# Altium project STM32F103_coreboard.PrjPcb
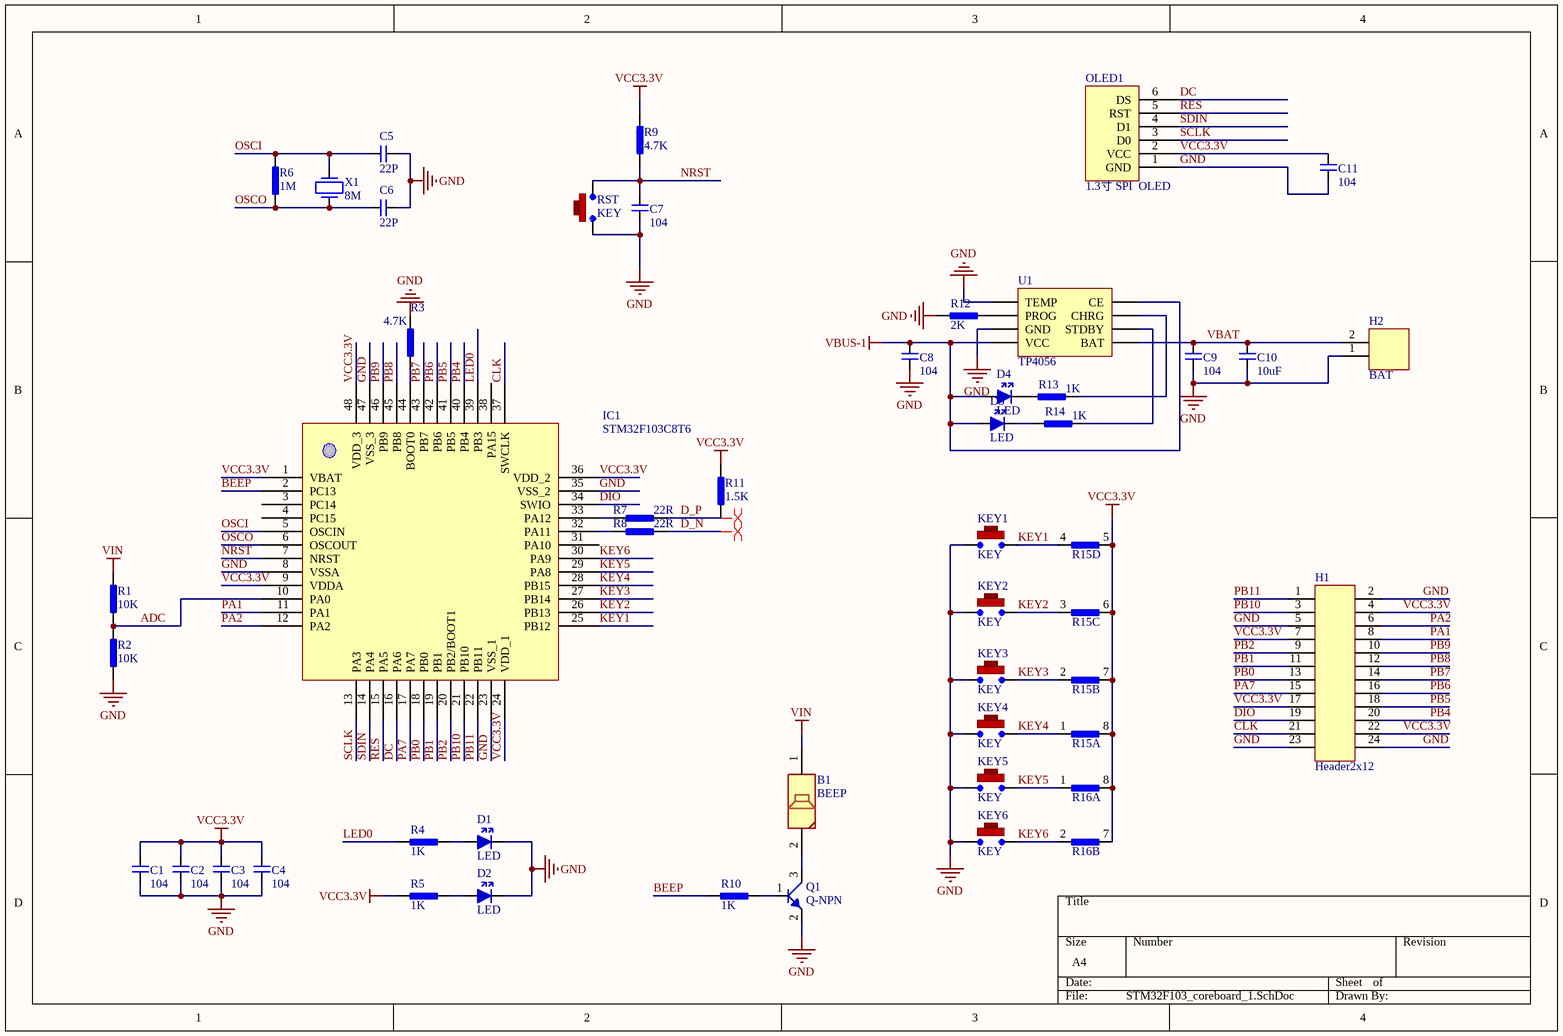
[diagram p0: STM32F103_coreboard_1.SchDoc]
2 sheets, 63 parts. Net scope: global (net labels, ports and power ports of the same name join across sheets).
Board file: STM32F103_coreboard.PcbDoc
Sheets:
  STM32F103_coreboard_1.SchDoc
  STM32F103_coreboard_2.SchDoc

## Sheet STM32F103_coreboard_1.SchDoc
size A4; SheetNumber: 1

### Parts
B1  BEEP  [MLT-9650]
C1  104  [C0603]
C2  104  [C0603]
C3  104  [C0603]
C4  104  [C0603]
C5  22P  [C0603]
C6  22P  [C0603]
C7  104  [C0603]
C8  104  [C0603]
C9  104  [C0603]
C10  10uF  [C0603]
C11  104  [C0603]
D1  LED  [LED0603]
D2  LED  [LED0603]
D3  LED  [LED0603]
D4  LED  [LED0603]
H1  Header2x12  [HDR2X12_2.54_180H]
H2  BAT  [BATIN]
IC1  STM32F103C8T6  [LQFP48]
KEY1  KEY  [KEY3X4X2.5]
KEY2  KEY  [KEY3X4X2.5]
KEY3  KEY  [KEY3X4X2.5]
KEY4  KEY  [KEY3X4X2.5]
KEY5  KEY  [KEY3X4X2.5]
KEY6  KEY  [KEY3X4X2.5]
OLED1  1.3寸 SPI  OLED  [OLED1.3INCH]
Q1  Q-NPN  [SOT-23]
R1  10K  [R0603]
R2  10K  [R0603]
R3  4.7K  [R0603]
R4  1K  [R0603]
R5  1K  [R0603]
R6  1M  [R0603]
R7  22R  [R0603]
R8  22R  [R0603]
R9  4.7K  [R0603]
R10  1K  [R0603]
R11  1.5K  [R0603]
R12  2K  [R0603]
R13  1K  [R0603]
R14  1K  [R0603]
R15  Res Pack-4R  [8P4R-0603]  (value not drawn)  (parts A,B,C,D of 4)
R16  Res Pack-4R  [8P4R-0603]  (value not drawn)  (parts A,B of 4)
RST  KEY  [KEY3X4X2.5]
U1  TP4056  [SOP8]
X1  8M  [XTAL-5032]

### Nets
GND: C1.1 C2.1 C3.1 C4.1 C5.2 C6.2 C7.1 C8.1 C9.1 C10.1 C11.1 D1.2 D2.2 H1.2 H1.5 H1.23 H1.24 H2.1 IC1.8(VSSA) IC1.23(VSS_1) IC1.35(VSS_2) IC1.47(VSS_3) KEY1.1 KEY2.1 KEY3.1 KEY4.1 KEY5.1 KEY6.1 OLED1.1(GND) Q1.2 R2.1 R3.2 R12.1 RST.1 U1.1(TEMP) U1.3(GND)
VBAT: C9.2 C10.2 H2.2 U1.5(BAT)
VBUS-1: C8.2 D3.1 D4.1 U1.4(VCC) U1.8(CE)
VCC3.3V: C1.2 C2.2 C3.2 C4.2 C11.2 H1.4 H1.7 H1.17 H1.22 IC1.1(VBAT) IC1.9(VDDA) IC1.24(VDD_1) IC1.36(VDD_2) IC1.48(VDD_3) OLED1.2(VCC) R5.1 R9.2 R11.2 R15.5 R15.6 R15.7 R15.8 R16.7 R16.8
VIN: B1.1 R1.2
ADC: IC1.10(PA0) R1.1 R2.2
BEEP: IC1.2(PC13) R10.1
CLK: H1.21 IC1.37(SWCLK)
D_N: R8.2
D_P: R7.2 R11.1
DC: IC1.16(PA6) OLED1.6(DS)
DIO: H1.19 IC1.34(SWIO)
KEY1: IC1.25(PB12) KEY1.2 R15.4
KEY2: IC1.26(PB13) KEY2.2 R15.3
KEY3: IC1.27(PB14) KEY3.2 R15.2
KEY4: IC1.28(PB15) KEY4.2 R15.1
KEY5: IC1.29(PA8) KEY5.2 R16.1
KEY6: IC1.30(PA9) KEY6.2 R16.2
LED0: IC1.39(PB3) R4.1
NRST: C7.2 IC1.7(NRST) R9.1 RST.2
OSCI: C5.1 IC1.5(OSCIN) R6.2 X1.2
OSCO: C6.1 IC1.6(OSCOUT) R6.1 X1.1
PA1: H1.8 IC1.11(PA1)
PA2: H1.6 IC1.12(PA2)
PA7: H1.15 IC1.17(PA7)
PB0: H1.13 IC1.18(PB0)
PB1: H1.11 IC1.19(PB1)
PB2: H1.9 IC1.20(PB2/BOOT1)
PB4: H1.20 IC1.40(PB4)
PB5: H1.18 IC1.41(PB5)
PB6: H1.16 IC1.42(PB6)
PB7: H1.14 IC1.43(PB7)
PB8: H1.12 IC1.45(PB8)
PB9: H1.10 IC1.46(PB9)
PB10: H1.3 IC1.21(PB10)
PB11: H1.1 IC1.22(PB11)
RES: IC1.15(PA5) OLED1.5(RST)
SCLK: IC1.13(PA3) OLED1.3(D0)
SDIN: IC1.14(PA4) OLED1.4(D1)
NetB1_2: B1.2 Q1.3
NetD1_1: D1.1 R4.2
NetD2_1: D2.1 R5.2
NetD3_2: D3.2 R14.1
NetD4_2: D4.2 R13.1
NetIC1_32: IC1.32(PA11) R8.1
NetIC1_33: IC1.33(PA12) R7.1
NetIC1_44: IC1.44(BOOT0) R3.1
NetQ1_1: Q1.1 R10.2
NetR12_2: R12.2 U1.2(PROG)
NetR13_2: R13.2 U1.7(CHRG)
NetR14_2: R14.2 U1.6(STDBY)

Not connected (* = marked no-connect by the designer): IC1 3(PC14) 4(PC15) 31(PA10) 38(PA15)

### Layout directives
differential pair: D_N, D_P

### Library data of the parts
C1-C11 = CAP
H2 = Header1x2
OLED1 = 1.3寸 SPI  OLED: 1.3寸 SPI  OLED 128x64 6线
R1-R14 = RES
R15 R16 = Res Pack-4R: 排阻; Sim Note: Enter the Resistance value into parameter field.; Value: 20R; Published: 24-Mar-1999; LatestRevisionDate: 29-May-2009; LatestRevisionNote: IPC-7351 Footprint Added.; PackageReference: SOIC16; Publisher: Altium Limited; PackageDescription: 16-Pin Small Outline Integrated Circuit 1.27 mm Pitch; Code_JEDEC: MS-012-AC; Code_IPC: SOIC127P600-16
X1 = XTAL

## Sheet STM32F103_coreboard_2.SchDoc
size A4; SheetNumber: 2
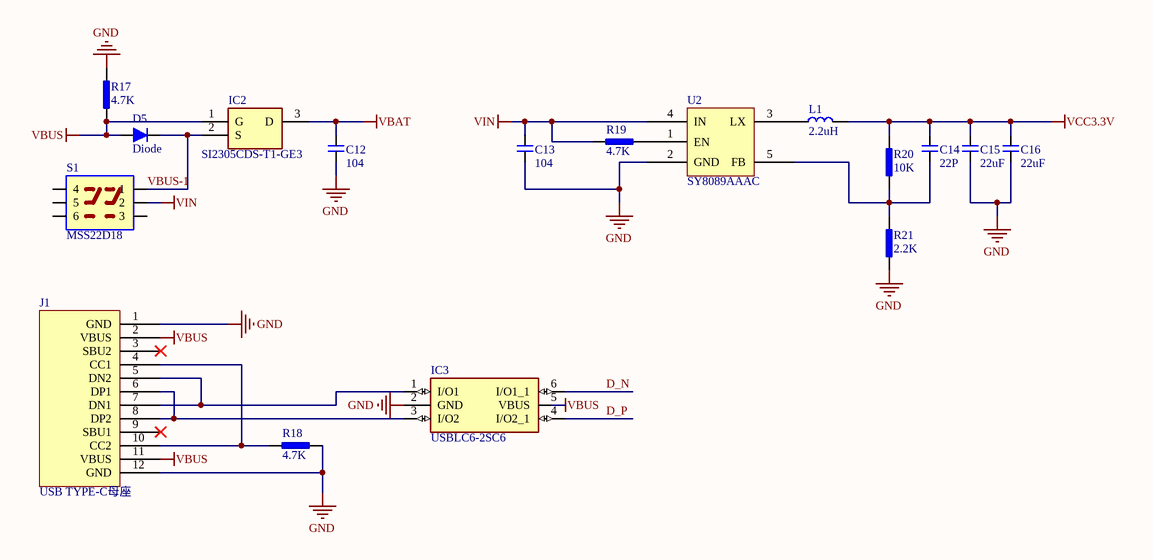
[diagram p1: STM32F103_coreboard_2.SchDoc]

### Parts
C12  104  [C0603]
C13  104  [C0603]
C14  22P  [C0603]
C15  22uF  [C0603]
C16  22uF  [C0603]
D5  Diode  [SOD123]
IC2  SI2305CDS-T1-GE3  [SOT95P237X112-3N]
IC3  USBLC6-2SC6  [SOT95P280X145-6N]
J1  USB TYPE-C母座  [USB-TYPEC-SMT]
L1  2.2uH  [L-CDR5*5]
R17  4.7K  [R0603]
R18  4.7K  [R0603]
R19  4.7K  [R0603]
R20  10K  [R0603]
R21  2.2K  [R0603]
S1  MSS22D18  [SWITCH-MSS22D18]
U2  SY8089AAAC  [SOT-23-5]

### Nets
GND: C12.1 C13.1 C15.1 C16.1 IC3.2(GND) J1.1(GND) J1.12(GND) R17.1 R18.2 R21.1 U2.2(GND)
VBAT: C12.2 IC2.3(D)
VBUS: D5.1 IC2.1(G) IC3.5(VBUS) J1.2(VBUS) J1.11(VBUS) R17.2
VBUS-1: D5.2 IC2.2(S) S1.1
VCC3.3V: C14.2 C15.2 C16.2 L1.1 R20.2
VIN: C13.2 R19.1 S1.2 U2.4(IN)
D_N: IC3.6(I/O1_1)
D_P: IC3.4(I/O2_1)
NetC14_1: C14.1 R20.1 R21.2 U2.5(FB)
NetIC3_1: IC3.1(I/O1) J1.5(DN2) J1.7(DN1)
NetIC3_3: IC3.3(I/O2) J1.6(DP1) J1.8(DP2)
NetJ1_4: J1.4(CC1) J1.10(CC2) R18.1
NetL1_2: L1.2 U2.3(LX)
NetR19_2: R19.2 U2.1(EN)

Not connected (* = marked no-connect by the designer): J1 3(SBU2)* 9(SBU1)*; S1 3 4 5 6

### Library data of the parts
C12-C16 = CAP
IC2 = SI2305CDS-T1-GE3: Integrated Circuit; Manufacturer_Name: Vishay; Allied_Number: R1082505; Datasheet Link: http://www.vishay.com/docs/64847/si2305cd.pdf; Height: 1.12mm; Manufacturer_Part_Number: SI2305CDS-T1-GE3; Mouser Part Number: 781-SI2305CDS-GE3; Mouser Price/Stock: https://www.mouser.com/Search/Refine.aspx?Keyword=781-SI2305CDS-GE3; RS Part Number: 7103248P; RS Price/Stock: http://uk.rs-online.com/web/p/products/7103248P; Allied Price/Stock: http://www.alliedelec.com/vishay-dale-si2305cds-t1-ge3/R1082505/
IC3 = USBLC6-2SC6: Integrated Circuit; Manufacturer_Name: STMicroelectronics; Allied_Number: 70389689; Datasheet Link: http://www.st.com/st-web-ui/static/active/en/resource/technical/document/datasheet/CD00050750.pdf; Height: 1.45mm; Manufacturer_Part_Number: USBLC6-2SC6; Mouser Part Number: 511-USBLC6-2SC6; Mouser Price/Stock: https://www.mouser.com/Search/Refine.aspx?Keyword=511-USBLC6-2SC6; RS Part Number: 6247693P; RS Price/Stock: http://uk.rs-online.com/web/p/products/6247693P; Allied Price/Stock: http://www.alliedelec.com/stmicroelectronics-usblc6-2sc6/70389689/
J1 = USB TYPE-C
L1 = Inductance
R17-R21 = RES
S1 = SWITCH-MSS22D18

## Nets that join several sheets
GND: STM32F103_coreboard_1 (36 pins), STM32F103_coreboard_2 (11 pins)
VBAT: STM32F103_coreboard_1 (C9.2 C10.2 H2.2 U1.5), STM32F103_coreboard_2 (C12.2 IC2.3)
VBUS-1: STM32F103_coreboard_1 (5 pins), STM32F103_coreboard_2 (D5.2 IC2.2 S1.1)
VCC3.3V: STM32F103_coreboard_1 (24 pins), STM32F103_coreboard_2 (5 pins)
VIN: STM32F103_coreboard_1 (B1.1 R1.2), STM32F103_coreboard_2 (C13.2 R19.1 S1.2 U2.4)
D_N: STM32F103_coreboard_1 (R8.2), STM32F103_coreboard_2 (IC3.6)
D_P: STM32F103_coreboard_1 (R7.2 R11.1), STM32F103_coreboard_2 (IC3.4)